# EAGLE design brick_3pin_led_bar (EAGLE 7.4.0)
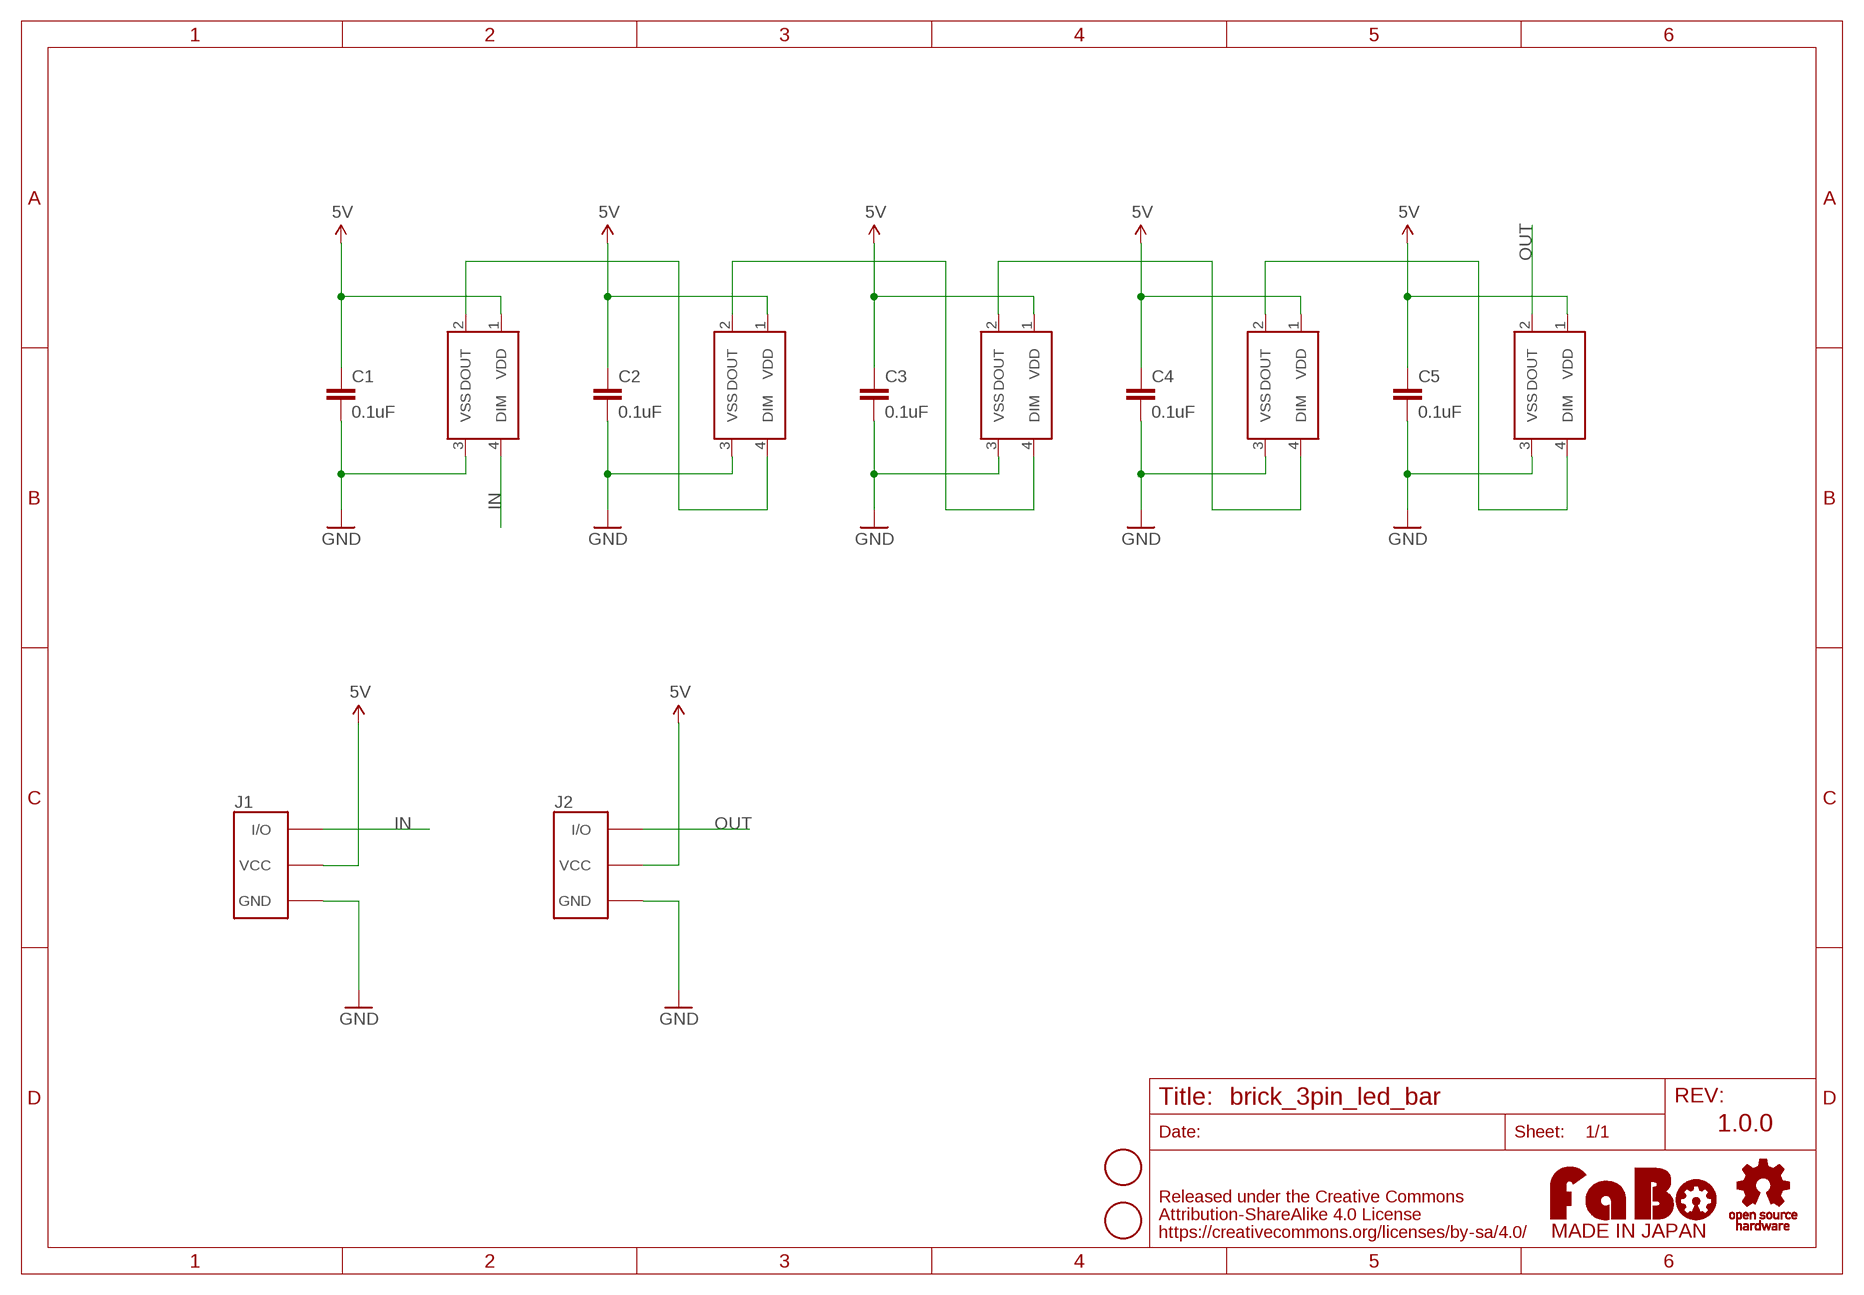
[diagram p0: schematic, sheet 1]

## Parts
C1  0.1uF  CAP-EIA0603  [EIA0603]
C2  0.1uF  CAP-EIA0603  [EIA0603]
C3  0.1uF  CAP-EIA0603  [EIA0603]
C4  0.1uF  CAP-EIA0603  [EIA0603]
C5  0.1uF  CAP-EIA0603  [EIA0603]
J1  FABO_BRICK_3PIN-CONNECTOR  [FABO_BRICK_3PIN_CONNECTOR]
J2  FABO_BRICK_3PIN-CONNECTOR  [FABO_BRICK_3PIN_CONNECTOR]
LED1  WS2818B  [WS2818B]
LED2  WS2818B  [WS2818B]
LED3  WS2818B  [WS2818B]
LED4  WS2818B  [WS2818B]
LED5  WS2818B  [WS2818B]
U$2  SCREW-PAD-3MM  [SCREWPAD_3MM]
U$3  SCREW-PAD-3MM  [SCREWPAD_3MM]
U$4  LOGO_FABO-S_BOTTOM  [LOGO_FABO_S_BOTTOM]
U$5  LOGO_OSHW-M_BOTTOM  [LOGO_OSHW_M_BOTTOM]

## Nets
5V: C1.1 C2.1 C3.1 C4.1 C5.1 J1.VCC J2.VCC LED1.1(VDD) LED2.1(VDD) LED3.1(VDD) LED4.1(VDD) LED5.1(VDD)
GND: C1.2 C2.2 C3.2 C4.2 C5.2 J1.GND J2.GND LED1.3(VSS) LED2.3(VSS) LED3.3(VSS) LED4.3(VSS) LED5.3(VSS)
IN: J1.IN/OUT(I/O) LED1.4(DIM)
N$1: LED2.2(DOUT) LED3.4(DIM)
N$4: LED3.2(DOUT) LED4.4(DIM)
N$5: LED1.2(DOUT) LED2.4(DIM)
N$7: LED4.2(DOUT) LED5.4(DIM)
OUT: J2.IN/OUT(I/O) LED5.2(DOUT)

## Notes on the sheet
- 1.0.0

## Library data of the parts
C1-C5 = FaBo-etc:CAP: Capacitor Standard 0603 ceramic capacitor
J1 J2 = FaBo-Template:FABO_BRICK_3PIN: FaBo Brick 3pin
LED1-LED5 = FaBo-LED:WS2818B
U$2 U$3 = FaBo-etc:SCREW-PAD
U$4 = FaBo-etc:LOGO_FABO
U$5 = FaBo-etc:LOGO_OSHW

## Board
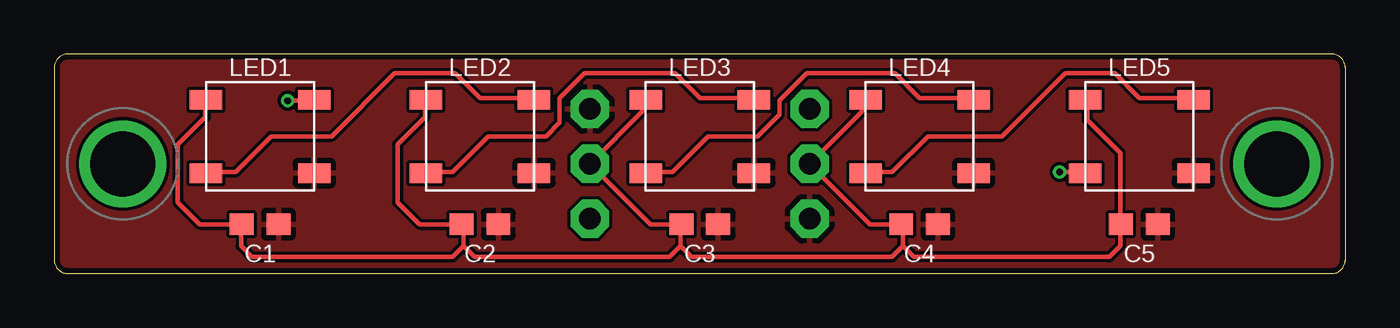
[diagram p1: board, top side]
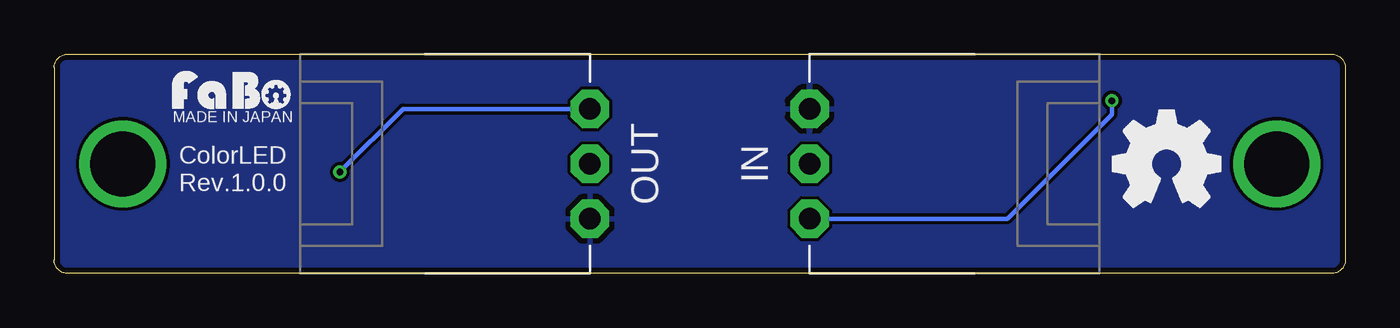
[diagram p2: board, bottom side, seen from below]

Size 59.69 x 10.16 mm. Coordinates in mm from the lower left corner, seen from the top.
Outline: 0.64,0 59.05,0 arc90 59.69,0.64 59.69,9.53 arc90 59.05,10.16 0.64,10.16 arc90 0,9.53 0,0.64 arc90 0.64,0
Copper layers (1*16): Top 0.035mm / dielectric 1.5mm / Bottom 0.035mm
Design rules "Elecrow_2-layer_eagle_rule": minimum track width 6mil, minimum drill 12mil, track to track 6mil, track to pad 6mil, pad to pad 6mil, via to via 6mil, smd to smd 0mil, copper to edge 10mil, drill to drill 10mil, minimum pad ring 10mil, minimum via ring 6mil, stop-mask expansion 2mil, vias tented up to drill 100mil, thermal gap 10mil

### Footprints (pad centres in the part's own frame; a part is rotated, then mirrored left to right if it is on the bottom)
EIA0603 = smd 1.1 x 1: 1 -0.85,0; 2 0.85,0
FABO_BRICK_3PIN_CONNECTOR = drill 1 pad 1.778 octagon: GND -2.54,0; IN/OUT 2.54,0; VCC 0,0
WS2818B = smd 1.5 x 0.9: 1 -2.5,1.7; 2 -2.5,-1.7; 3 2.5,-1.7; 4 2.5,1.7
SCREWPAD_3MM = drill 3 pad 3.81: 1 0,0

### Placement (x,y rotation side)
C1  9.53,2.29 0 top
C2  19.68,2.29 0 top
C3  29.84,2.29 0 top
C4  40.01,2.29 0 top
C5  50.16,2.29 0 top
J1  24.77,5.08 270 bottom
J2  34.92,5.08 90 bottom
LED1  9.53,6.35 0 top
LED2  19.68,6.35 0 top
LED3  29.84,6.35 0 top
LED4  40.01,6.35 0 top
LED5  50.16,6.35 0 top
U$2  3.17,5.08 0 top
U$3  56.52,5.08 0 top
U$4  51.44,7.62 0 top
U$5  8.26,5.08 0 top

### Tracks (layer width: path | path; a pad name or v marks a point on that pad's centre or on a via)
5V
  Top 0.203: 39.24,1.27 39.75,0.76 48.77,0.76 49.28,1.27 49.28,2.03 49.31,2.07 C5.1 49.31,2.5 49.28,2.54 49.28,5.59 47.75,7.11 47.75,7.96 LED5.1 | 39.24,1.27 39.24,2.2 C4.1 37.72,2.29 J2.VCC 37.34,7.49 37.34,7.88 LED4.1 | 28.96,1.27 28.96,2.03 29,2.07 C3.1 27.56,2.29 J1.VCC 27.18,7.49 27.18,7.88 LED3.1 | 28.96,1.27 29.46,0.76 38.73,0.76 39.24,1.27 | 18.92,1.27 18.92,1.91 18.84,1.99 C2.1 16.89,2.29 15.88,3.3 15.88,5.97 17.14,7.24 17.14,8 LED2.1 | 18.92,1.27 19.43,0.76 28.45,0.76 28.96,1.27 | 18.92,1.27 18.41,0.76 9.14,0.76 8.64,1.27 8.64,2.16 8.68,2.2 C1.1 6.73,2.29 5.71,3.3 5.71,5.97 6.99,7.24 6.99,8 LED1.1
GND
  pour Top: -1.27,-1.27 60.96,-1.27 60.96,11.43 -1.27,11.43
  pour Bottom: -1.27,-1.27 60.96,-1.27 60.96,11.43 -1.27,11.43
IN  (via drill 0.3)
  Top 0.203: LED1.4 11.73,8.05 11.68,8 v10.79,8
  Bottom 0.203: v10.79,8 10.79,7.37 15.62,2.54 J1.IN/OUT
N$1
  Top 0.203: LED2.2 17.48,4.65 17.53,4.7 18.41,4.7 20.07,6.35 22.73,6.35 23.37,6.99 23.37,8.13 24.51,9.27 28.7,9.27 29.84,8.13 32.27,8.13 LED3.4
N$4
  Top 0.203: LED3.2 27.76,4.65 27.81,4.7 28.57,4.7 30.23,6.35 32.51,6.35 33.53,7.37 33.53,8 34.8,9.27 38.86,9.27 40.01,8.13 42.43,8.13 LED4.4
N$5
  Top 0.203: LED1.2 7.07,4.7 8.38,4.7 10.03,6.35 12.83,6.35 15.75,9.27 18.54,9.27 19.68,8.13 22.11,8.13 LED2.4
N$7
  Top 0.203: LED4.2 37.92,4.65 37.97,4.7 38.73,4.7 40.39,6.35 43.81,6.35 46.74,9.27 49.02,9.27 50.16,8.13 52.59,8.13 LED5.4
OUT  (via drill 0.3)
  Top 0.203: LED5.2 47.62,4.7 v46.48,4.7
  Bottom 0.203: v46.48,4.7 43.56,7.62 J2.IN/OUT

### Text on the board
bPlace: MADE IN JAPAN | IN | OUT | ColorLED | Rev.1.0.0